# EAGLE design G1-3 (EAGLE 7.6.0)
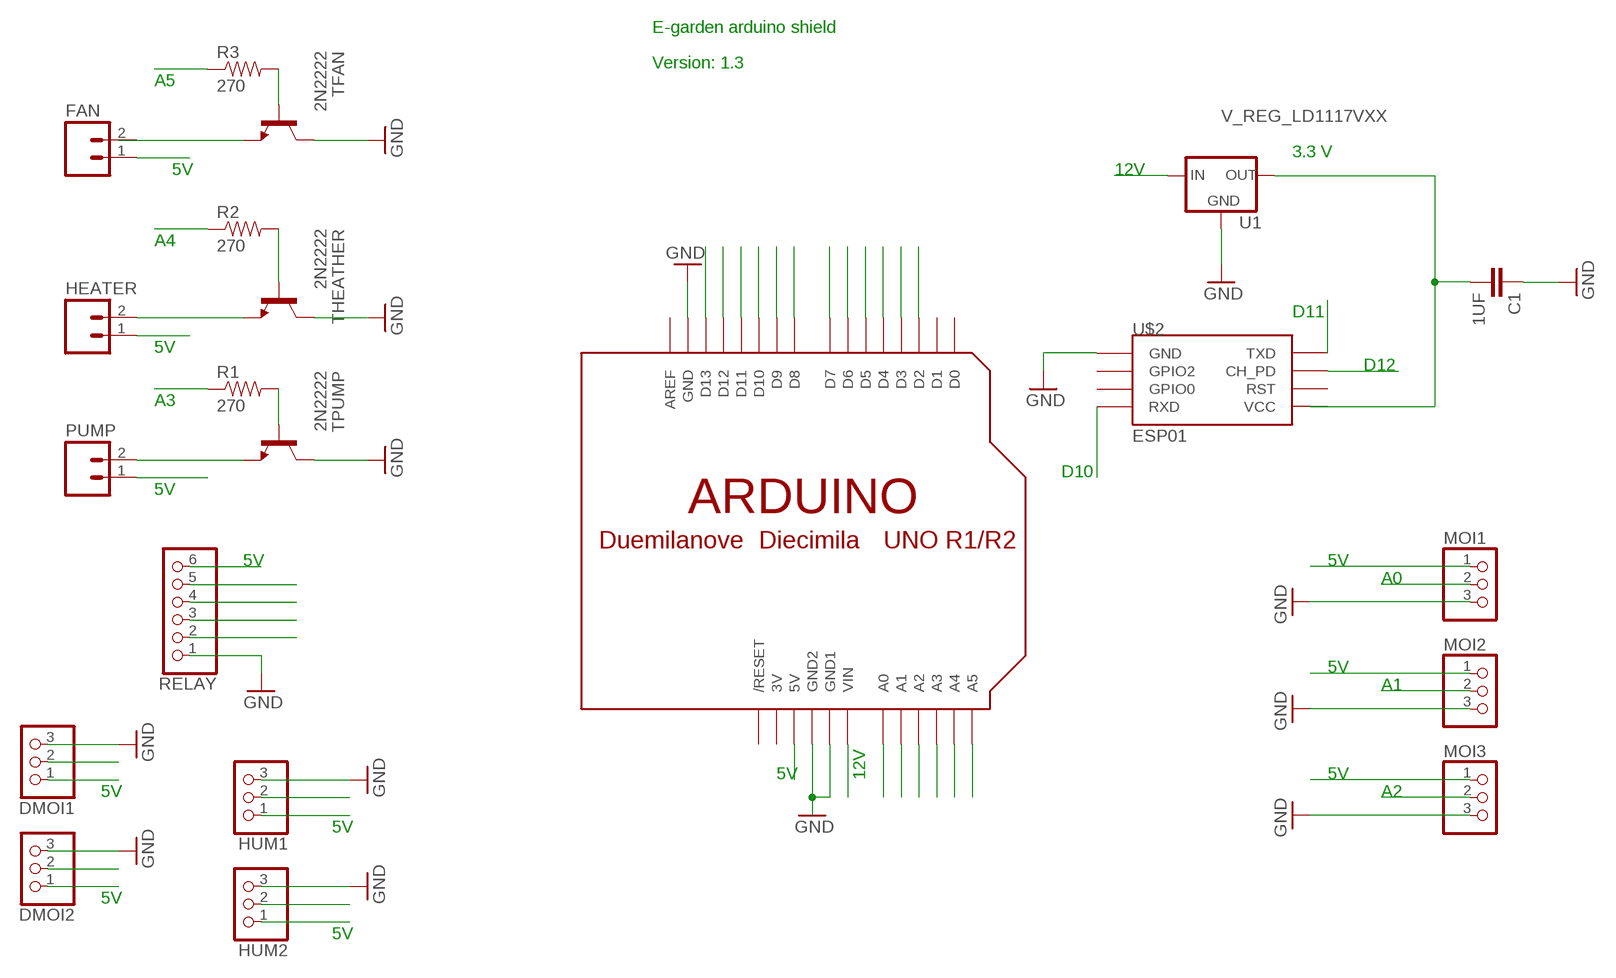
[diagram p0: schematic, sheet 1]

## Parts
C1  1UF  CAPKIT  [CAP-PTH-SMALL-KIT]
DMOI1  PINHD-1X3CB  [1X03-CLEANBIG]
DMOI2  PINHD-1X3CB  [1X03-CLEANBIG]
FAN  M02PTH  [1X02]
HEATER  M02PTH  [1X02]
HUM1  PINHD-1X3CB  [1X03-CLEANBIG]
HUM2  PINHD-1X3CB  [1X03-CLEANBIG]
MOI1  PINHD-1X3CB  [1X03-CLEANBIG]
MOI2  PINHD-1X3CB  [1X03-CLEANBIG]
MOI3  PINHD-1X3CB  [1X03-CLEANBIG]
PUMP  M02PTH  [1X02]
R1  270  RESISTORPTH-1/4W  [AXIAL-0.4]
R2  270  RESISTORPTH-1/4W  [AXIAL-0.4]
R3  270  RESISTORPTH-1/4W  [AXIAL-0.4]
RELAY  PINHD-1X6CB  [1X06-CLEANBIG]
TFAN  2N2222  [TO92-EBC-OVAL]
THEATHER  2N2222  [TO92-EBC-OVAL]
TPUMP  2N2222  [TO92-EBC-OVAL]
U1  V_REG_LD1117VXX  [78XXL]
U$1  ARDUINO-BPLACE  [ARDUINO-BPLACE]
U$2  ESP01  [ESP01]

## Nets
A0: MOI1.2 U$1.A0
A1: MOI2.2 U$1.A1
A2: MOI3.2 U$1.A2
A3: R1.P$1 U$1.A3
A4: R2.P$1 U$1.A4
A5: R3.P$1 U$1.A5
D2: HUM1.2 U$1.D2
D3: HUM2.2 U$1.D3
D4: DMOI1.2 U$1.D4
D5: DMOI2.2 U$1.D5
D6: RELAY.2 U$1.D6
D7: RELAY.3 U$1.D7
D8: RELAY.4 U$1.D8
D9: RELAY.5 U$1.D9
D10: U$1.D10 U$2.RX(RXD)
D11: U$1.D11 U$2.TX(TXD)
D12: U$1.D12 U$2.CH_PD
D13: U$1.D13
GND: C1.1 DMOI1.3 DMOI2.3 HUM1.3 HUM2.3 MOI1.3 MOI2.3 MOI3.3 RELAY.1 TFAN.C THEATHER.C TPUMP.C U1.IN(GND) U$1.GND U$1.GND1 U$1.GND2 U$2.GND
N$1: FAN.2 TFAN.E
N$3: HEATER.2 THEATHER.E
N$4: PUMP.2 TPUMP.E
N$5: R3.P$2 TFAN.B
N$6: R2.P$2 THEATHER.B
N$7: R1.P$2 TPUMP.B
N$8: C1.2 U1.GND(OUT) U$2.VCC
V5: DMOI1.1 DMOI2.1 FAN.1 HEATER.1 HUM1.1 HUM2.1 MOI1.1 MOI2.1 MOI3.1 PUMP.1 RELAY.6 U$1.5V
V12: U1.OUT(IN) U$1.VIN
Unconnected: U$1.AREF U$1.D0 U$1.D1 U$1.RESET(/RESET) U$2.GPIO0 U$2.GPIO2 U$2.RST

## Notes on the sheet
- E-garden arduino shield
- Version: 1.3
- A5
- 3.3 V
- 5V | 12V
- A4
- D11
- 5V
- D12
- A3
- D10
- 5V
- 5V | 5V
- A0
- 5V
- A1
- 5V | 12V | 5V
- 5V | A2
- 5V
- 5V
- 5V

## Power pins joined to a net without a drawn wire
3V: U$1.3V

## Library data of the parts
C1 = SparkFun-Capacitors:CAP: Capacitor Standard 0603 ceramic capacitor, and 0.1" leaded capacitor.
DMOI1 DMOI2 HUM1 HUM2 MOI1-MOI3 = adafruit:PINHD-1X3: PIN HEADER
FAN HEATER PUMP = SparkFun-Connectors:M02: Standard 2-pin 0.1" header. Use with - straight break away headers ( PRT-00116) - right angle break away headers (PRT-00553) - swiss pins (PRT-00743) - machine pins (PRT-00117) - female headers (PRT-00115) Molex polarized connector foot print use with: PRT-08233 with associated crimp pins and housings. 2.54_SCREWTERM for use with PRT-10571. 3.5mm Screw Terminal footprints for PRT-08084 5mm Screw Terminal footprints for use with PRT-08432
R1-R3 = SparkFun-Passives:RESISTOR: Resistor Basic schematic elements and footprints for 0603, 1206, and PTH resistors.
RELAY = adafruit:PINHD-1X6: PIN HEADER
TFAN THEATHER TPUMP = adafruit:2N2222: NPN TRANSISTOR Big oval pads
U1 = SparkFun-PowerIC:V_REG_LD1117VXX: LD1117VXX voltage regulator. We carry the 3.3V version (COM-00526) in TO-220 package.
U$1 = adafruit:ARDUINO: Arduino Diecimila/Duemilanove Make a shield with ease, this package has all the named pins as well as the two mounting drill holes and an outline of the USB and DC power connector. The outline is on the DIMENSION layer, so if your board house uses it they will cut the outline to match. http://www.ladyada.net/library/pcb/eaglelibrary.html
U$2 = esp8266modules:ESP01: ESP8266 Wifi module 01

## Board
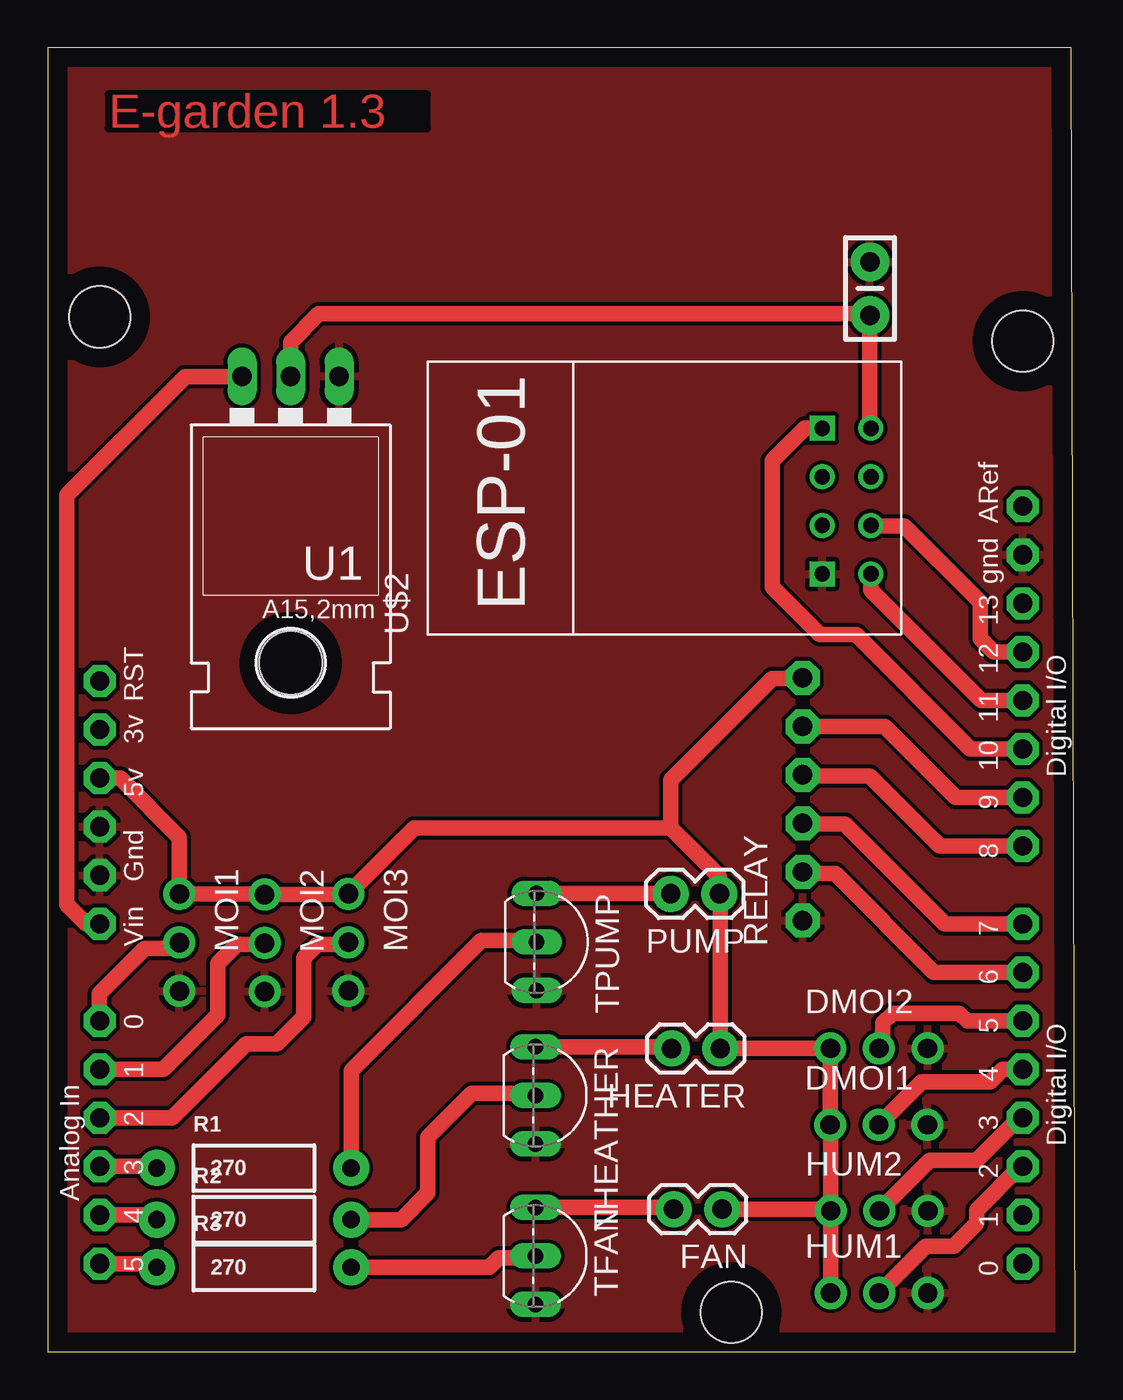
[diagram p1: board, top side]
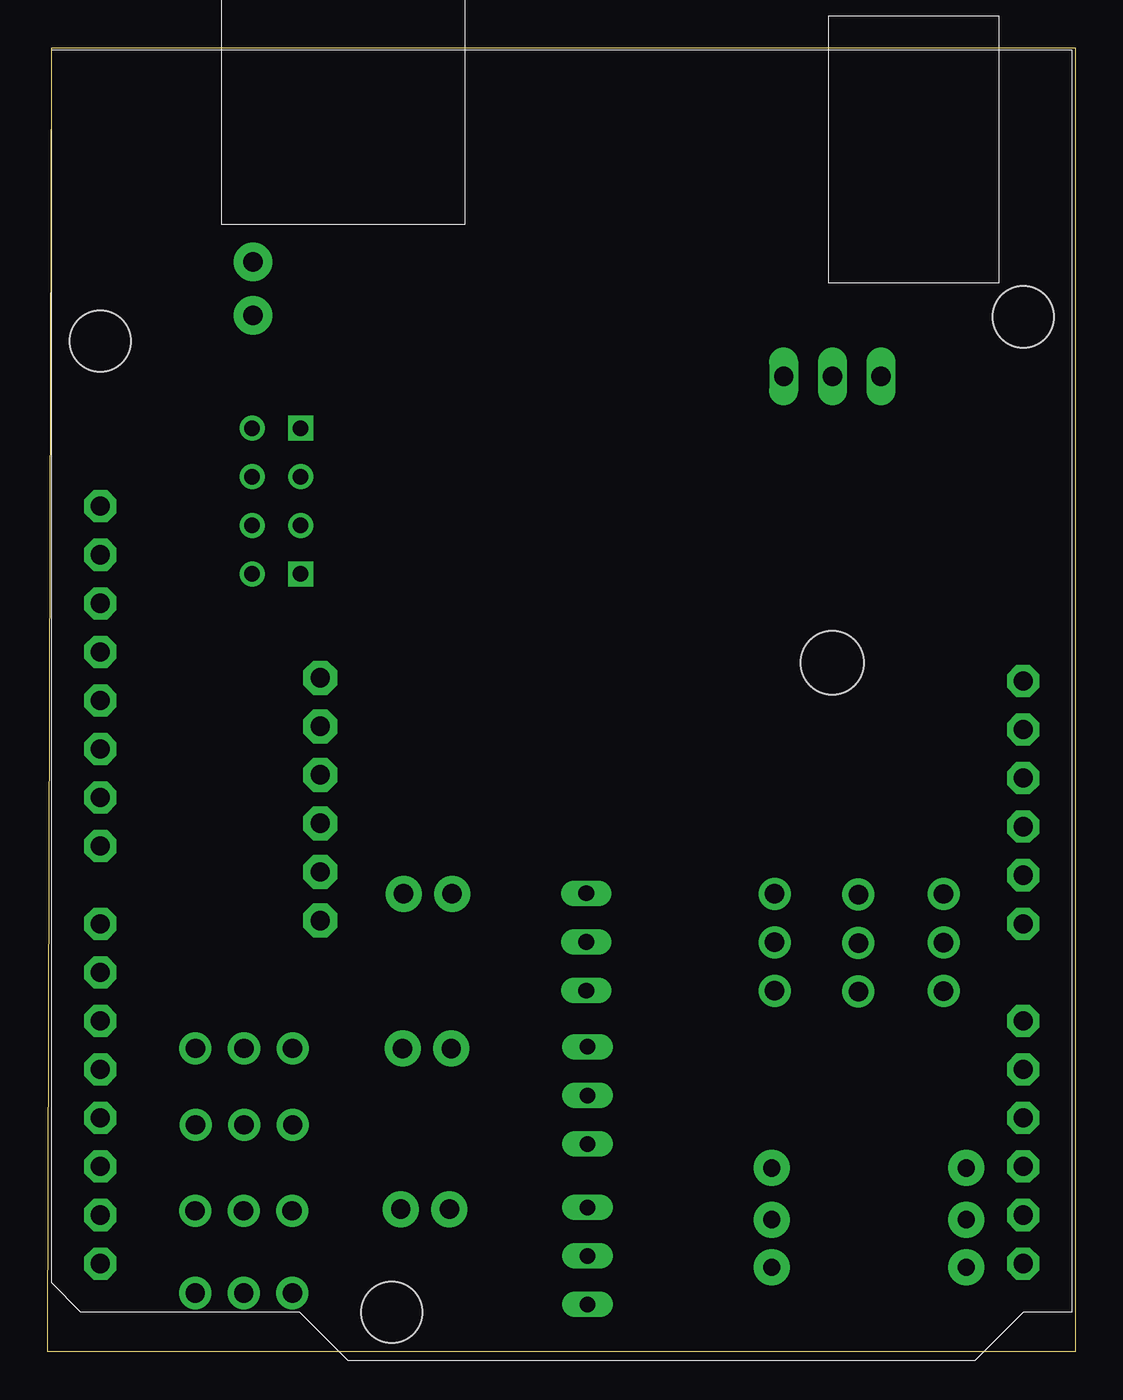
[diagram p2: board, bottom side, seen from below]

Size 53.73 x 68.22 mm. Coordinates in mm from the lower left corner, seen from the top.
Outline: 0,0 53.73,0 53.53,68.22 0,68.22 0,0
Copper layers (1*16): Top 0.035mm / dielectric 1.5mm / Bottom 0.035mm
Design rules "default": minimum track width 10mil, minimum drill 24mil, track to track 8mil, track to pad 8mil, pad to pad 8mil, via to via 8mil, smd to smd 8mil, copper to edge 40mil, drill to drill 8mil, minimum pad ring 10mil, minimum via ring 8mil, stop-mask expansion 4mil, vias tented up to drill 0mil, thermal gap 10mil

### Footprints (pad centres in the part's own frame; a part is rotated, then mirrored left to right if it is on the bottom)
CAP-PTH-SMALL-KIT = drill 1.016 pad 2.032: 1 -1.397,0; 2 1.397,0
1X03-CLEANBIG = drill 1.016 pad 1.676: 1 -2.54,0; 2 0,0; 3 2.54,0
1X02 = drill 1.016 pad 1.88: 1 0,0; 2 2.54,0
AXIAL-0.4 = drill 0.9 pad 1.88: P$1 -5.08,0; P$2 5.08,0
1X06-CLEANBIG = drill 1.016 pad 1.778 octagon: 1 -6.35,0; 2 -3.81,0; 3 -1.27,0; 4 1.27,0; 5 3.81,0; 6 6.35,0
TO92-EBC-OVAL = drill 0.813 long: B 0,-1.27; C 2.54,-1.27; E -2.54,-1.27
78XXL = drill 1.016 long: GND 0,-3.81; IN -2.54,-3.81; OUT 2.54,-3.81 | hole 3.302: 0,11.176
ARDUINO-BPLACE = drill 1 pad 1.676 octagon: 3V 35.56,2.54; 5V 38.1,2.54; A0 50.8,2.54; A1 53.34,2.54; A2 55.88,2.54; A3 58.42,2.54; A4 60.96,2.54; A5 63.5,2.54; AREF 23.876,50.8; D0 63.5,50.8; D1 60.96,50.8; D2 58.42,50.8; D3 55.88,50.8; D4 53.34,50.8; D5 50.8,50.8; D6 48.26,50.8; D7 45.72,50.8; D8 41.656,50.8; D9 39.116,50.8; D10 36.576,50.8; D11 34.036,50.8; D12 31.496,50.8; D13 28.956,50.8; GND 26.416,50.8; GND1 43.18,2.54; GND2 40.64,2.54; RESET 33.02,2.54; VIN 45.72,2.54 | hole 3.2: 15.24,50.8; 66.04,35.56; 13.97,2.54
ESP01 = drill 0.8: CH_PD -1.285,-8.178; GPIO0 1.255,-5.638; GPIO2 -1.285,-5.638; RST 1.255,-8.178; TX -3.825,-8.178; VCC 3.795,-8.178 | drill 0.8 square: GND -3.825,-5.638; RX 3.795,-5.638

### Placement (x,y rotation side)
C1  43,55.62 270 top
DMOI1  43.46,11.87 0 top
DMOI2  43.47,15.87 0 top
FAN  35.27,7.46 180 top
HEATER  35.17,15.86 180 top
HUM1  43.48,3.07 0 top
HUM2  43.49,7.37 0 top
MOI1  6.88,21.41 270 top
MOI2  11.34,21.38 270 top
MOI3  15.72,21.42 270 top
PUMP  35.12,23.96 180 top
R1  10.78,9.61 0 top
R2  10.78,6.91 0 top
R3  10.78,4.41 0 top
RELAY  39.48,28.91 90 top
TFAN  26.78,5.01 270 top
THEATHER  26.78,13.41 270 top
TPUMP  26.84,21.44 270 top
U1  12.7,47.22 180 top
U$1  0.18,68.11 270 top
U$2  34.87,44.52 90 top

### Tracks (layer width: path | path; a pad name or v marks a point on that pad's centre or on a via)
A0
  Top 0.813: U$1.A0 2.68,17.31 2.68,18.71 5.08,21.11 6.58,21.11 MOI1.2
A1
  Top 0.813: U$1.A1 6.04,14.77 8.88,17.61 8.88,20.31 9.88,21.31 11.27,21.31 MOI2.2
A2
  Top 0.813: U$1.A2 6.5,12.23 10.38,16.11 11.98,16.11 13.38,17.51 13.38,20.61 14.08,21.31 15.61,21.31 MOI3.2
A3
  Top 0.813: U$1.A3 5.7,9.69 R1.P$1
A4
  Top 0.813: U$1.A4 5.7,7.15 R2.P$1
A5
  Top 0.813: U$1.A5 5.7,4.61 R3.P$1
D2
  Top 0.813: U$1.D2 50.86,9.69 48.58,7.41 48.58,6.71 47.38,5.51 45.92,5.51 HUM1.2
D3
  Top 0.813: U$1.D3 50.8,12.23 48.58,10.01 46.13,10.01 HUM2.2
D4
  Top 0.813: U$1.D4 49.94,14.77 49.28,14.11 45.7,14.11 DMOI1.2
D5
  Top 0.813: U$1.D5 48.08,17.31 47.68,17.71 44.18,17.71 43.68,17.21 43.68,16.08 DMOI2.2
D6
  Top 0.813: U$1.D6 46.34,19.85 41.18,25.01 39.57,25.01 RELAY.2
D7
  Top 0.813: U$1.D7 46.9,22.39 41.68,27.61 39.51,27.61 RELAY.3
D8
  Top 0.813: U$1.D8 46.64,26.45 42.98,30.11 39.55,30.11 RELAY.4
D9
  Top 0.813: U$1.D9 47.5,28.99 43.78,32.71 RELAY.5
D10
  Top 0.813: U$1.D10 48.26,31.53 42.28,37.51 40.38,37.51 37.88,40.01 37.88,46.61 39.58,48.31 U$2.RX
D11
  Top 0.813: U$1.D11 48.82,34.07 43.05,39.84 U$2.TX
D12
  Top 0.813: U$1.D12 49.48,36.61 48.78,37.31 48.78,39.21 44.78,43.21 43.07,43.21 U$2.CH_PD
GND
  pour Top: 0.18,68.01 53.68,68.11 53.68,0.01 0.08,0.01
N$1
  Top 0.813: TFAN.E 32.64,7.55 FAN.2
N$3
  Top 0.813: THEATHER.E 32.54,15.95 HEATER.2
N$4
  Top 0.813: TPUMP.E 32.56,23.98 PUMP.2
N$5
  Top 0.813: R3.P$2 23.08,4.41 23.58,4.91 25.41,4.91 TFAN.B
N$6
  Top 0.813: R2.P$2 18.48,6.91 19.88,8.31 19.88,11.21 22.18,13.51 25.41,13.51 THEATHER.B
N$7
  Top 0.813: R1.P$2 15.86,14.69 22.68,21.51 25.5,21.51 TPUMP.B
N$8
  Top 0.813: U1.GND 12.7,52.83 14.18,54.31 42.91,54.31 C1.2 43,48.36 U$2.VCC
V5
  Top 0.813: U$1.5V 3.78,30.01 6.88,26.91 MOI1.1 11.31,23.95 MOI2.1 15.68,23.92 MOI3.1 19.17,27.41 32.58,27.41 | 32.58,27.41 35.12,24.87 PUMP.1 35.17,23.91 HEATER.1 DMOI2.1 DMOI1.1 40.95,11.84 HUM2.1 | HUM2.1 HUM1.1 | HUM2.1 40.84,7.46 FAN.1 | 32.58,27.41 32.58,29.91 37.88,35.21 39.43,35.21 RELAY.6
V12
  Top 0.813: U$1.VIN 2,22.39 0.98,23.41 0.98,44.81 7.18,51.01 10.14,51.01 U1.OUT

### Text on the board
Top: E-garden 1.3